# EasyEDA Pro project ProPrj_UCC21520隔离半桥模块_2026-01-25.epro

# Schematic Schematic1
Board Name: UCC21520驱动模块; Create Date: 2025-07-15; Page Name: P1; Project Name: UCC21520隔离半桥模块; Schematic Name: Schematic1; Update Date: 2025-07-16; Company: 嘉立创EDA; Page Size: A2; Version: V1.0
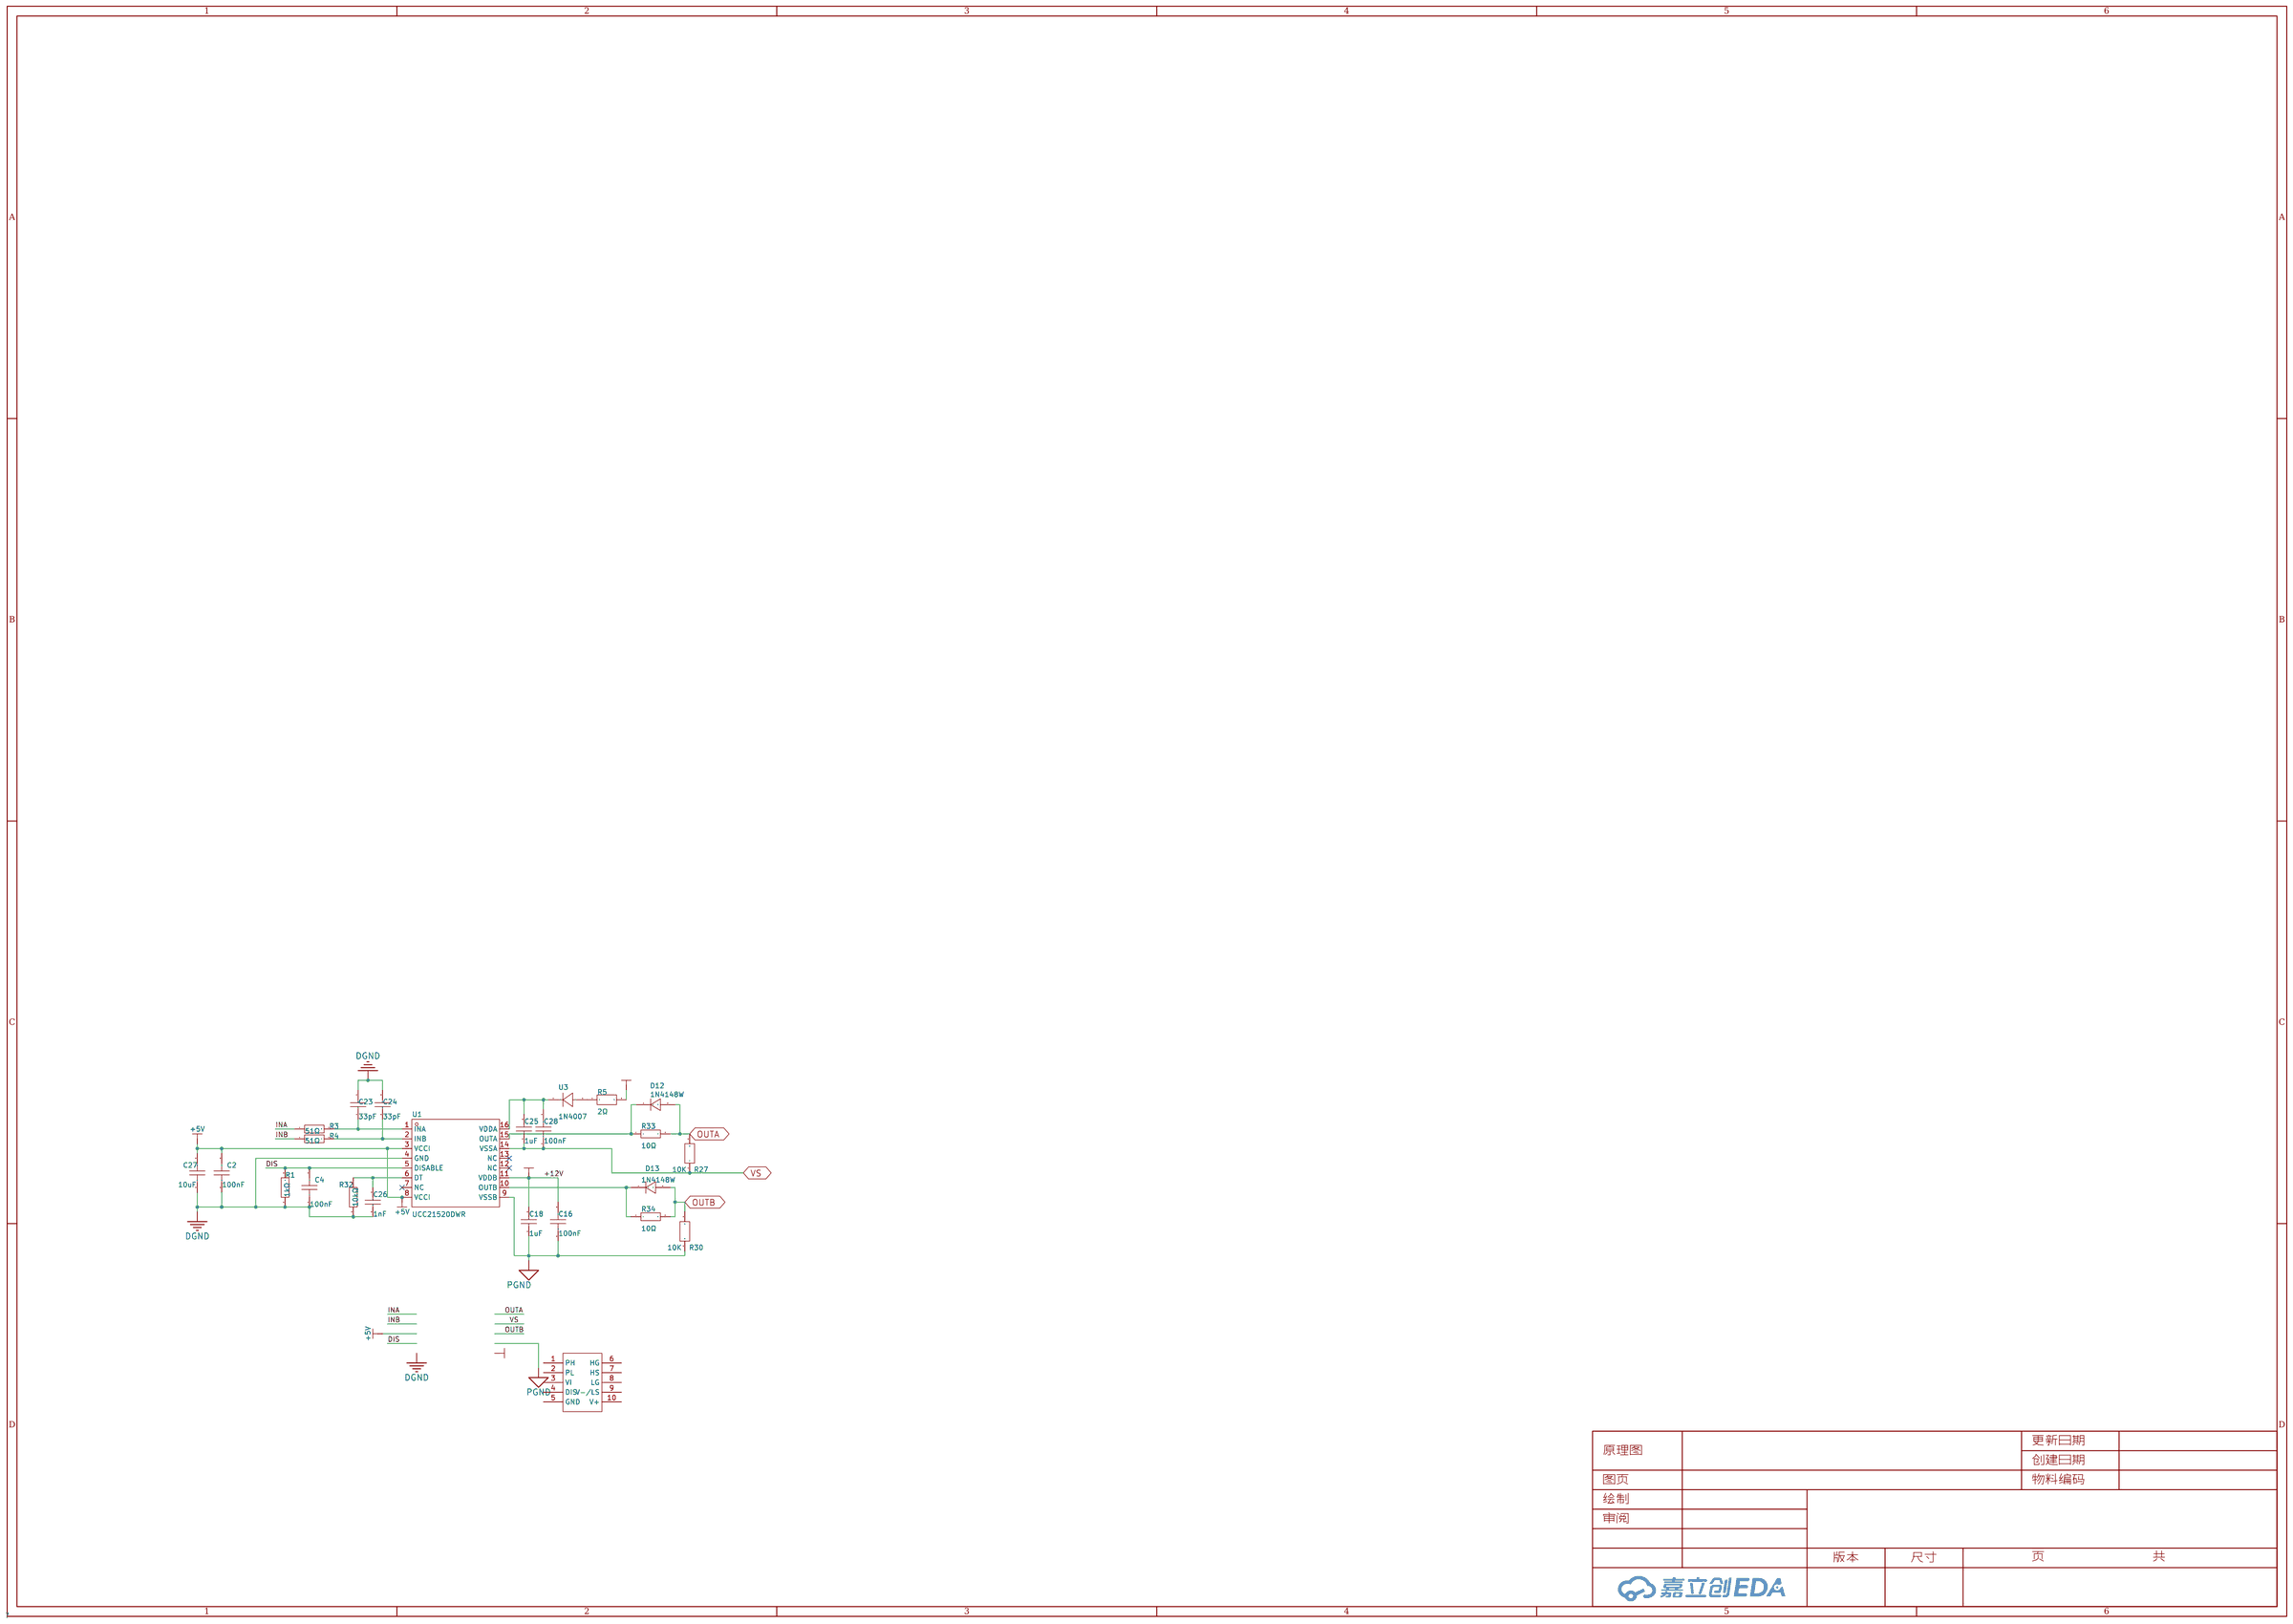
[diagram p0: schematic sheet]

## Parts
C2  100nF  [C0603]
C4  100nF  [C0603]
C16  100nF  [C0603]
C18  1uF  [C0603]
C23  33pF  [C0603]
C24  33pF  [C0603]
C25  1uF  [C0603]
C26  1nF  [C0603]
C27  10uF  [C0603]
C28  100nF  [C0603]
D12  1N4148W  [SOD-123FL_L2.6-W1.6-LS3.4-RD]
D13  1N4148W  [SOD-123FL_L2.6-W1.6-LS3.4-RD]
R1  1kΩ  [R0603]
R3  51Ω  [R0603]
R4  51Ω  [R0603]
R5  2Ω  [R0603]
R27  10K  [R0603]
R30  10K  [R0603]
R32  10kΩ  [R0603]
R33  10Ω  [R0603]
R34  10Ω  [R0603]
U1  UCC21520DWR  [SOIC-16_L10.3-W7.5-P1.27-LS10.3-BL]
U2  -  [UCC21520模块]
U3  1N4007  [SMA_L4.3-W2.6-LS5.1-RD]

## Library data of the parts
C2 C4 C16 C28 = CC0603KRX7R9BB104: 容值:100nF;精度:±10%;额定电压:50V;材质(温度系数):X7R;; LCSC Part Name: 100nF ±10% 50V; Supplier Part: C14663; Manufacturer: YAGEO(国巨); Supplier Footprint: 0603; JLCPCB Part Class: 基础库; Datasheet: https://atta.szlcsc.com/upload/public/pdf/source/20180910/C282072_33301C7F631E79921B82A8DAC6BCC5B3.pdf; Supplier: LCSC; Tolerance: ±10%; Voltage Rated: 50V; Temperature Coefficient: X7R
C18 C25 = CL10A105KB8NNNC: 容值:1uF;精度:±10%;额定电压:50V;材质(温度系数):X5R;; LCSC Part Name: 1uF ±10% 50V; Supplier Part: C15849; Manufacturer: SAMSUNG(三星); Supplier Footprint: 0603; JLCPCB Part Class: 基础库; Datasheet: https://atta.szlcsc.com/upload/public/pdf/source/20160218/1457707763339.pdf; Supplier: LCSC; Tolerance: ±10%; Voltage Rated: 50V; Temperature Coefficient: X5R
C23 C24 = CL10C330JB8NNNC: 容值:33pF;精度:±5%;额定电压:50V;材质(温度系数):C0G;; LCSC Part Name: 33pF ±5% 50V; Supplier Part: C1663; Manufacturer: SAMSUNG(三星); Supplier Footprint: 0603; JLCPCB Part Class: 基础库; Datasheet: https://atta.szlcsc.com/upload/public/pdf/source/20160218/1457707763339.pdf; Supplier: LCSC; Tolerance: ±5%; Voltage Rated: 50V; Temperature Coefficient: C0G
C26 = CL10B102KB8NNNC: 容值:1nF;精度:±10%;额定电压:50V;材质(温度系数):X7R;; LCSC Part Name: 1nF ±10% 50V; Supplier Part: C1588; Manufacturer: SAMSUNG(三星); Supplier Footprint: 0603; JLCPCB Part Class: 基础库; Datasheet: https://atta.szlcsc.com/upload/public/pdf/source/20160218/1457707763339.pdf; Supplier: LCSC; Tolerance: ±10%; Voltage Rated: 50V; Temperature Coefficient: X7R
C27 = CGA0603X5R106K100JT: 容值:10uF;精度:±10%;额定电压:10V;温度系数:X5R;; LCSC Part Name: 10uF ±10% 10V; Supplier Part: C6119842; Manufacturer: HRE(芯声); Supplier Footprint: 0603; JLCPCB Part Class: 扩展库; Supplier: LCSC; Tolerance: ±10%; Voltage Rating: 10V; Temperature Coefficient: X5R
D12 D13 = 1N4148W: Supplier: LCSC; Manufacturer: Tak Cheong; Supplier Part: C129216
R1 = 0603WAF1001T5E: 电阻类型:厚膜电阻;阻值:1kΩ;精度:±1%;功率:100mW;最大工作电压:75V;温度系数:±100ppm/℃;; LCSC Part Name: 1kΩ ±1% 100mW 厚膜电阻; Supplier Part: C21190; Manufacturer: UNI-ROYAL(厚声); Supplier Footprint: 0603; JLCPCB Part Class: Basic Part; Datasheet: https://atta.szlcsc.com/upload/public/pdf/source/20200306/C422600_1E6D84923E4A46A82E41ADD87F860B5C.pdf; Supplier: LCSC; Type: 厚膜电阻; Tolerance: ±1%; Power(Watts): 100mW; Overload Voltage (Max): 75V; Temperature Coefficient: ±100ppm/℃; Operating Temperature Range: -55℃~+155℃
R3 R4 = 0603WAF510JT5E: 电阻类型:厚膜电阻;阻值:51Ω;精度:±1%;功率:100mW;最大工作电压:75V;温度系数:±100ppm/℃;; LCSC Part Name: 51Ω ±1% 100mW 厚膜电阻; Supplier Part: C23197; Manufacturer: UNI-ROYAL(厚声); Supplier Footprint: 0603; JLCPCB Part Class: 基础库; Datasheet: https://atta.szlcsc.com/upload/public/pdf/source/20200306/C422600_1E6D84923E4A46A82E41ADD87F860B5C.pdf; Supplier: LCSC; Type: 厚膜电阻; Tolerance: ±1%; Power(Watts): 100mW; Overload Voltage (Max): 75V; Temperature Coefficient: ±100ppm/℃; Operating Temperature Range: -55℃~+155℃
R5 = FRC0603J2R0 TS: 电阻类型:厚膜电阻;阻值:2Ω;精度:±5%;功率:100mW;最大工作电压:75V;温度系数:±200ppm/℃;; LCSC Part Name: 2Ω ±5% 100mW 厚膜电阻; Supplier Part: C2907139; Manufacturer: FOJAN(富捷); Supplier Footprint: 0603; JLCPCB Part Class: 扩展库; Datasheet: https://atta.szlcsc.com/upload/public/pdf/source/20211221/925EC7D7225764EE0046F22065062C87.pdf; Supplier: LCSC; Type: 厚膜电阻; Tolerance: ±5%; Power(Watts): 100mW; Overload Voltage (Max): 75V; Temperature Coefficient: ±200ppm/℃; Operating Temperature Range: -55℃~+155℃
R27 R30 = 10K
R32 = 0603WAF1002T5E: 电阻类型:厚膜电阻;阻值:10kΩ;精度:±1%;功率:100mW;最大工作电压:75V;温度系数:±100ppm/℃;; LCSC Part Name: 厚膜电阻 10kΩ ±1% 100mW; Supplier Part: C25804; Manufacturer: UNI-ROYAL(厚声); Supplier Footprint: 0603; JLCPCB Part Class: 基础库; Datasheet: https://atta.szlcsc.com/upload/public/pdf/source/20200306/C422600_1E6D84923E4A46A82E41ADD87F860B5C.pdf; Supplier: LCSC; Type: 厚膜电阻; Tolerance: ±1%; Power(Watts): 100mW; Overload Voltage (Max): 75V; Temperature Coefficient: ±100ppm/℃; Operating Temperature Range: -55℃~+155℃
R33 R34 = 0603WAF100JT5E: 电阻类型:厚膜电阻;阻值:10Ω;精度:±1%;功率:100mW;最大工作电压:75V;温度系数:±400ppm/℃;; LCSC Part Name: 10Ω ±1% 100mW 厚膜电阻; Supplier Part: C22859; Manufacturer: UNI-ROYAL(厚声); Supplier Footprint: 0603; JLCPCB Part Class: 基础库; Datasheet: https://atta.szlcsc.com/upload/public/pdf/source/20200306/C422600_1E6D84923E4A46A82E41ADD87F860B5C.pdf; Supplier: LCSC; Type: 厚膜电阻; Tolerance: ±1%; Power(Watts): 100mW; Overload Voltage (Max): 75V; Temperature Coefficient: ±400ppm/℃; Operating Temperature Range: -55℃~+155℃
U1 = UCC21520DWR: UCC21520 4A/6A、5.7 kVrms 双通道隔离式栅极驱动器; Supplier Part: C601651; Manufacturer: TI(德州仪器); Supplier Footprint: SOIC-16; JLCPCB Part Class: Extended Part; Supplier: LCSC
U2 = UCC21520驱动模块
U3 = 1N4007: Supplier Part: C9900004759; JLCPCB Part Class: 扩展库; Supplier: LCSC

## Nets
+5V: C2.2 C27.2 U1.3(VCCI) U1.8(VCCI)
+12V: C16.2 C18.2 R5.2 U1.11(VDDB)
DGND: C2.1 C4.1 C23.2 C24.2 C26.1 C27.1 R1.1 R32.1 U1.4(GND)
PGND: C16.1 C18.1 R30.1 U1.9(VSSB)
DIS: C4.2 R1.2 U1.5(DISABLE)
INA: R3.1
INB: R4.1
OUTA: D12.2 R27.2 R33.2
OUTB: D13.2 R30.2 R34.2
VS: C25.1 C28.1 R27.1 U1.14(VSSA)
$1N1333: C25.2 C28.2 U1.16(VDDA) U3.1(K)
$1N1336: D12.1 R33.1 U1.15(OUTA)
$1N1339: C26.2 R32.2 U1.6(DT)
$1N2277: C23.1 R3.2 U1.1(INA)
$1N2325: C24.1 R4.2 U1.2(INB)
$1N2966: D13.1 R34.1 U1.10(OUTB)
$1N3293: R5.1 U3.2(A)

Not connected (* = marked no-connect by the designer): U1 7(NC)* 12(NC)* 13(NC)*; U2 1(PH) 2(PL) 3(VI) 4(DIS) 5(GND) 6(HG) 7(HS) 8(LG) 9(V-/LS) 10(V+)

# Board PCB3
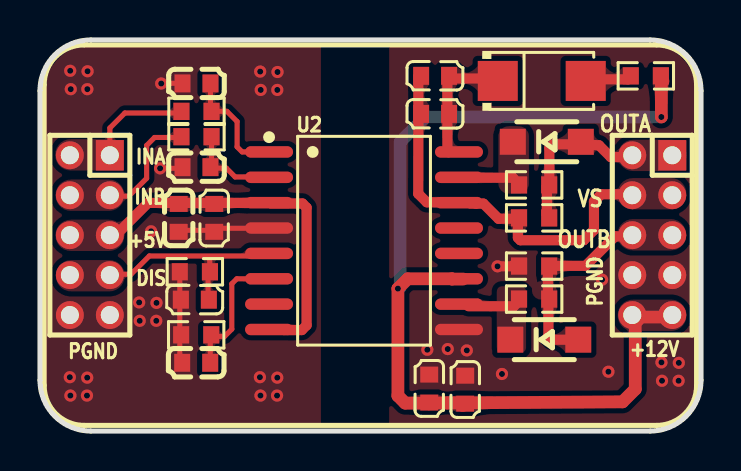
[diagram p1: board, top side]
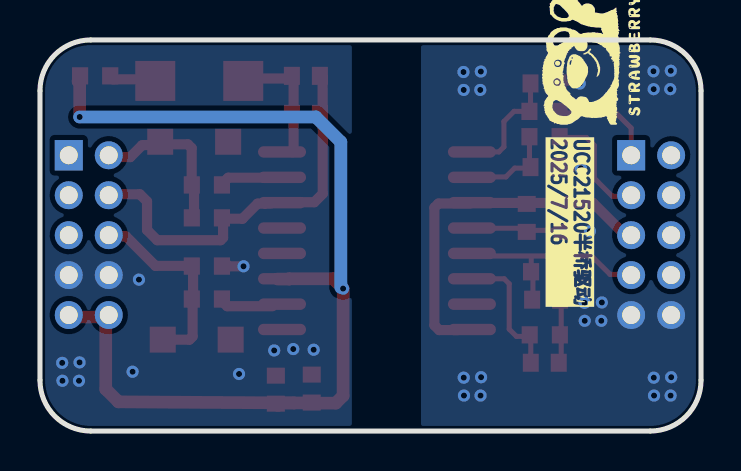
[diagram p2: board, bottom side, seen from below]

Outline 33.07 x 19.58 mm; copper layers: Top Layer, Bottom Layer. Coordinates in mm from the lower left corner of the outline.
Outline path: 0,17.04 0,2.54 arc(0.74,0.74) 2.54,0 30.53,0 arc(32.33,0.74) 33.07,2.54 33.07,17.04 arc(32.33,18.84) 30.53,19.58 2.54,19.58 arc(0.74,18.84) 0,17.04
Stack: Top Layer 0.035mm / Dielectric1 1.51mm FR4 er 4.5 / Bottom Layer 0.035mm

## Design rules (mm)
template: 自定义配置
spacing copperThickness1oz (default): track to track 0.102, other pairs 0.152 to 0.3
spacing copperThickness2oz: track to track 0.203, other pairs 0.152 to 0.3
track width copperThickness1oz (default): min 0.127, default 0.254, max 2.54
track width copperThickness2oz: min 0.203, default 0.254, max 2.54
differential pair differentialPair (default): width min 0.127, default 0.254, max 2.54; gap min 0.152, default 0.152
via viaSize (default): diameter min 0.5, default 0.61, max 10; hole min 0.3, default 0.305, max 6.3

## Placement (name value [footprint] x y rotation side)
C2  100nF  [C0603]  8.72 10.67 90 top
C4  100nF  [C0603]  7.75 6.58 0 top
C16  100nF  [C0603]  19.47 2.13 270 top
C18  1uF  [C0603]  21.27 2.07 270 top
C23  33pF  [C0603]  7.83 17.4 180 top
C24  33pF  [C0603]  7.83 13.21 180 top
C25  1uF  [C0603]  19.77 17.78 0 top
C26  1nF  [C0603]  7.82 3.42 0 top
C27  10uF  [C0603]  6.94 10.67 90 top
C28  100nF  [C0603]  19.77 15.88 0 top
D12  1N4148W  [SOD-123FL_L2.6-W1.6-LS3.4-RD]  25.35 14.48 0 top
D13  1N4148W  [SOD-123FL_L2.6-W1.6-LS3.4-RD]  25.23 4.58 0 top
R1  1kΩ  [R0603]  7.75 7.97 0 top
R3  51Ω  [R0603]  7.83 16.01 0 top
R4  51Ω  [R0603]  7.83 14.74 0 top
R5  2Ω  [R0603]  30.31 17.78 0 top
R27  10K  [R0603]  24.72 10.67 0 top
R30  10K  [R0603]  24.72 8.26 0 top
R32  10kΩ  [R0603]  7.82 4.82 0 top
R33  10Ω  [R0603]  24.72 12.32 0 top
R34  10Ω  [R0603]  24.72 6.61 0 top
U1  UCC21520DWR  [SOIC-16_L10.3-W7.5-P1.27-LS10.3-BL]  16.21 9.53 270 top
U2  -  [UCC21520模块]  17.73 9.66 270 top
U3  1N4007  [SMA_L4.3-W2.6-LS5.1-RD]  25.1 17.53 0 top

## Footprints (pads in the part's own frame, mm; a bottom-side part is the same pattern mirrored in y, then rotated)
C0603
  rect 0.8x0.9 smd: 1(-0.7,0) 2(0.7,0)
R0603
  rect 0.806x0.864 smd: 1(-0.753,0) 2(0.753,0)
SMA_L4.3-W2.6-LS5.1-RD
  rect 2x2 smd: 1(-2.2,0) 2(2.2,0)
SOD-123FL_L2.6-W1.6-LS3.4-RD
  rect 1.3x1.3 smd: 1(-1.7,0) 2(1.7,0)
SOIC-16_L10.3-W7.5-P1.27-LS10.3-BL
  oval 0.574x2.401 smd: 1(-4.445,-4.75) 2(-3.175,-4.75) 3(-1.905,-4.75) 4(-0.635,-4.75) 5(0.635,-4.75) 6(1.905,-4.75) 7(3.175,-4.75) 8(4.445,-4.75) 9(4.445,4.75) 10(3.175,4.75) 11(1.905,4.75) 12(0.635,4.75) 13(-0.635,4.75) 14(-1.905,4.75) 15(-3.175,4.75) 16(-4.445,4.75)
UCC21520模块
  rect 1.524x1.4 hole 0.9: 1(-4.151,-14.24) 6(-4.151,13.895)
  round 1.4 hole 0.9: 1(-4.151,-16.24) 2(-2.151,-14.24) 2(-2.151,-16.24) 3(-0.151,-14.24) 3(-0.151,-16.24) 4(1.849,-14.24) 4(1.849,-16.24) 5(3.849,-14.24) 5(3.849,-16.24) 6(-4.151,11.895) 7(-2.151,13.895) 7(-2.151,11.895) 8(-0.151,13.895) 8(-0.151,11.895) 9(1.849,13.895) 9(1.849,11.895) 10(3.849,13.895) 10(3.849,11.895)

## Nets
+5V: C2.2 C27.2 U1.3 U1.8 U2.3
+12V: C16.2 C18.2 R5.2 U1.11 U2.10
DGND: C2.1 C4.1 C23.2 C24.2 C26.1 C27.1 R1.1 R32.1 U1.4 U2.5
PGND: C16.1 C18.1 R30.1 U1.9 U2.9
DIS: C4.2 R1.2 U1.5 U2.4
INA: R3.1 U2.1
INB: R4.1 U2.2
OUTA: D12.2 R27.2 R33.2 U2.6
OUTB: D13.2 R30.2 R34.2 U2.8
VS: C25.1 C28.1 R27.1 U1.14 U2.7
$1N1333: C25.2 C28.2 U1.16 U3.1
$1N1336: D12.1 R33.1 U1.15
$1N1339: C26.2 R32.2 U1.6
$1N2277: C23.1 R3.2 U1.1
$1N2325: C24.1 R4.2 U1.2
$1N2966: D13.1 R34.1 U1.10
$1N3293: R5.1 U3.2

Pads without a net: U1 7 12 13

## Via types
v1: diameter 0.61, hole 0.305, Top Layer to Bottom Layer, 36 vias

## Routing (per net, layer and track width the routed paths; a pad name or vN(x,y) marks a point on that pad's centre or on a via; arc(x,y) is an arc through that point)
+5V: length 16.8
  Top Layer w0.508: 10.83,11.42 5.4,11.42 3.76,9.78 ; 11.55,11.39 13.13,11.39 13.34,11.19 13.34,5.3 13.1,5.06 12.2,5.06 12.16,5.09
+12V: length 49.8
  Top Layer w0.635: v1(31.08,15.72) 31.08,17.44 31.16,17.52 ; 21.16,1.28 21.03,1.41 20.36,1.41 ; 20.36,1.41 29.14,1.46 29.78,2.1 29.78,5.64 29.85,5.71 31.31,5.71 ; 20.36,1.41 19.5,1.41 ; 21.17,7.61 20.61,7.61 20.6,7.62 18.4,7.62 v1(17.91,7.13) 17.91,1.77 18.27,1.4 19.5,1.4 19.46,1.36
  Bottom Layer w0.635: 18.02,7.19 18.02,14.47 19.27,15.72 v1(31.08,15.72)
DGND: length 10.7
  Top Layer w0.254: 8.75,9.92 8.75,10.15 10.81,10.15 10.83,10.13 ; 7.19,17.41 6.08,17.41 v1(6.06,17.4) ; 7.03,3.36 6.99,3.39 6.99,4.77 ; 6.99,4.77 6.99,7.84 ; 6.99,4.77 6.93,4.84 ; 6.82,10.05 8.48,10.05 8.53,10 ; 6.97,13.15 v1(6.01,13.15)
  vias: v1(1.51,18.04) v1(1.49,2.7) v1(1.52,1.78) v1(1.54,17.12) v1(2.38,18.01) v1(2.37,17.12) v1(2.36,2.67) v1(2.35,1.78) v1(4.96,6.44) v1(4.99,5.52) v1(5.56,10) v1(5.83,6.42) v1(5.82,5.52) v1(11.01,18) v1(11,2.7) v1(11.03,1.78) v1(11.04,17.08) v1(11.88,17.98) v1(11.87,17.08) v1(11.87,2.67) v1(11.86,1.78)
PGND: length 0.9
  Top Layer w0.508: 23.72,8.34 23.62,8.25 v1(22.89,8.25)
  vias: v1(19.38,4.07) v1(20.4,4.11) v1(21.35,4.04) v1(23.11,2.86) v1(28.12,7.58) v1(28.44,2.97) v1(31.09,3.44) v1(31.12,2.52) v1(31.96,3.41) v1(31.95,2.52)
DIS: length 10.2
  Top Layer w0.254: 8.47,8.74 8.49,8.72 8.49,7.97 ; 3.58,7.85 4.55,7.85 5.47,8.77 11.04,8.77 11.15,8.88 ; 8.41,7.97 8.41,6.75 8.52,6.64
INA: length 5.1
  Top Layer w0.254: 3.5,13.9 3.5,15.17 4.25,15.92 6.8,15.92 6.93,16.05
INB: length 5.6
  Top Layer w0.254: 6.95,14.7 5.73,14.7 5.34,14.3 5.34,12.65 4.44,11.76 3.55,11.76
OUTA: length 7.6
  Top Layer w0.508: 25.36,12.31 25.36,10.78 ; 29.54,13.72 28.55,13.72 27.96,14.31 27.11,14.35 25.67,14.35 25.48,14.17 25.48,12.48
OUTB: length 9.4
  Top Layer w0.508: 27.05,4.57 25.59,4.57 25.43,4.73 25.43,6.58 ; 29.38,9.75 28.77,9.75 27.29,8.27 25.41,8.27 25.39,8.25 ; 25.41,8.1 25.41,6.84
VS: length 18.9
  Top Layer w0.508: 21.52,11.39 21.8,11.39 21.8,11.39 22.18,11.39 22.94,10.63 23.81,10.63 ; 23.91,10.53 23.91,9.68 24.03,9.55 27.2,9.55 27.71,10.06 27.71,11.5 28.07,11.86 29.64,11.86 29.79,11.7 ; 20.52,11.46 19.35,11.46 18.92,11.88 18.93,17.76
$1N1333: length 6
  Top Layer w0.508: 20.58,17.65 22.53,17.65 22.59,17.6 ; 20.43,13.96 20.38,14.01 20.38,17.89
$1N1336: length 2.5
  Top Layer w0.508: 23.72,12.62 23.66,12.68 21.23,12.68
$1N1339: length 5.7
  Top Layer w0.254: 8.45,3.46 8.52,3.52 8.52,4.65 ; 10.5,7.62 9.85,7.62 9.6,7.37 9.6,5.1 9.23,4.74 8.59,4.74
$1N2277: length 5.9
  Top Layer w0.254: C23.1 8.53,16.06 R3.2 9.35,16.01 9.86,15.5 9.86,14.23 10.11,13.97 U1.1
$1N2325: length 3.7
  Top Layer w0.254: 10.79,12.72 9.76,12.72 9.32,13.16 8.7,13.16 ; 8.53,13.34 8.58,13.39 R4.2
$1N2966: length 2.6
  Top Layer w0.508: 21.43,6.25 23.7,6.25 23.95,6.5
$1N3293: length 2.5
  Top Layer w0.508: 29.62,17.81 29.42,17.61 27.25,17.61

## Copper pours and planes (outline as drawn; the poured copper is in the pictures)
+5V on Top Layer: 0.78,10.58 4.22,10.58 4.22,9.02 0.78,9.02
+12V on Top Layer: 28.9,6.58 32.34,6.58 32.34,5.01 28.9,5.01
DGND on Top Layer: -0.78,21.5 14.05,21.5 14.05,-1.95 -0.78,-1.95
DGND on Top Layer: 0.77,6.57 4.21,6.57 4.21,5 0.77,5
DGND on Bottom Layer: -0.95,21.61 14.01,21.61 14.01,-1.95 -0.95,-1.95
PGND on Top Layer: 18.79,5.44 22.38,5.44 22.38,2.38 18.79,2.38
PGND on Top Layer: 28.88,8.6 32.32,8.6 32.32,7.03 28.88,7.03
PGND on Top Layer: 17.46,20.39 33.67,20.39 33.67,-2.26 17.46,-2.26
PGND on Bottom Layer: 17.46,21.2 34.09,21.2 34.09,-1.41 17.46,-1.41
DIS on Top Layer: 0.79,8.56 4.23,8.56 4.23,6.99 0.79,6.99
INA on Top Layer: 0.76,14.61 4.2,14.61 4.2,13.05 0.76,13.05
INB on Top Layer: 0.78,12.59 4.22,12.59 4.22,11.02 0.78,11.02
OUTA on Top Layer: 28.91,14.58 32.35,14.58 32.35,13.02 28.91,13.02
OUTB on Top Layer: 28.89,10.61 32.33,10.61 32.33,9.04 28.89,9.04
VS on Top Layer: 28.89,12.66 32.33,12.66 32.33,11.1 28.89,11.1
$1N1336 on Top Layer: 22.93,15.26 24.46,15.26 24.46,11.89 22.93,11.89
$1N2966 on Top Layer: 22.85,7.25 24.32,7.25 24.32,3.92 22.85,3.92

Small or netless copper shapes (teardrops, artwork), in the pictures only: 86 on Top Layer, 1 on Bottom Layer

## Text on the board
Bottom Silkscreen Layer: UCC21520半桥驱动 / 2025/7/16
Top Silkscreen Layer: PGND | +5V | INB | INA | DIS | +12V | VS | OUTA | OUTB
